# Altium schematic sheet mikrokontroller.SchDoc
size A
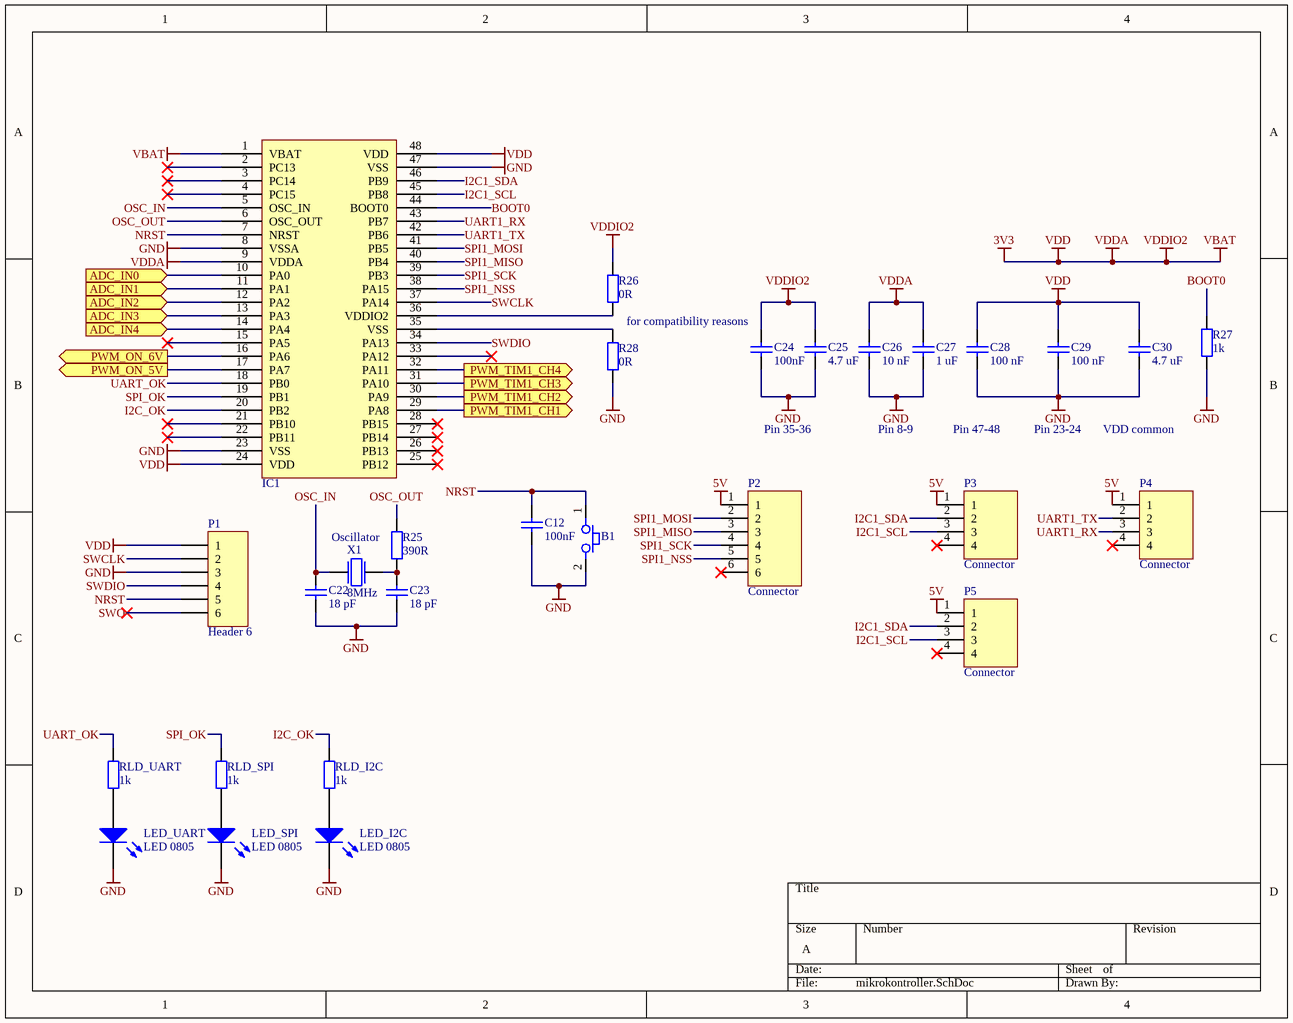
[diagram p0: mikrokontroller.SchDoc]

## Parts
B1  Button small  [FP_BTN_SMD_3x6]  (value not drawn)
C12  100nF  [0805_C]
C22  18 pF  [0805_C]
C23  18 pF  [0805_C]
C24  100nF  [0805_C]
C25  4.7 uF  [0805_C]
C26  10 nF  [0805_C]
C27  1 uF  [0805_C]
C28  100 nF  [0805_C]
C29  100 nF  [0805_C]
C30  4.7 uF  [0805_C]
IC1  STM32F091CBT6  [LQFP48]  (value not drawn)
LED_I2C  LED 0805  [0805_LED_G]
LED_SPI  LED 0805  [0805_LED_G]
LED_UART  LED 0805  [0805_LED_G]
P1  Header 6  [HDR1X6]
P2  Connector  [FP_CONN6_TAP_254MM]
P3  Connector  [FP_CONN4_TAP_254MM]
P4  Connector  [FP_CONN4_TAP_254MM]
P5  Connector  [FP_CONN4_TAP_254MM]
R25  390R  [0805_R]
R26  0R  [0805_R]
R27  1k  [0805_R]
R28  0R  [0805_R]
RLD_I2C  1k  [0805_R]
RLD_SPI  1k  [0805_R]
RLD_UART  1k  [0805_R]
X1  8MHz  [FP_CRYSTAL_HC49]

## Ports
ADC_IN0 (in), ADC_IN1 (in), ADC_IN2 (in), ADC_IN3 (in), ADC_IN4 (in), PWM_ON_5V (out), PWM_ON_6V (out), PWM_TIM1_CH1 (out), PWM_TIM1_CH2 (out), PWM_TIM1_CH3 (out), PWM_TIM1_CH4 (out)

## Nets
3V3: C24.1 C25.1 C26.1 C27.1 C28.1 C29.1 C30.1 IC1.1(VBAT) IC1.9(VDDA) IC1.24(VDD) IC1.48(VDD) P1.1 R26.2  [also labelled VBAT, VDD, VDDA, VDDIO2]
5V: P2.1 P3.1 P4.1 P5.1
GND: B1.2 C12.1 C22.2 C23.2 C24.2 C25.2 C26.2 C27.2 C28.2 C29.2 C30.2 IC1.8(VSSA) IC1.23(VSS) IC1.47(VSS) LED_I2C.2(K) LED_SPI.2(K) LED_UART.2(K) P1.3 R27.1 R28.1
ADC_IN0: IC1.10(PA0) ; port ADC_IN0
ADC_IN1: IC1.11(PA1) ; port ADC_IN1
ADC_IN2: IC1.12(PA2) ; port ADC_IN2
ADC_IN3: IC1.13(PA3) ; port ADC_IN3
ADC_IN4: IC1.14(PA4) ; port ADC_IN4
BOOT0: IC1.44(BOOT0) R27.2
I2C1_SCL: IC1.45(PB8) P3.3 P5.3
I2C1_SDA: IC1.46(PB9) P3.2 P5.2
I2C_OK: IC1.20(PB2) RLD_I2C.1
NRST: B1.1 C12.2 IC1.7(NRST) P1.5
OSC_IN: C22.1 IC1.5(OSC_IN) X1.1
OSC_OUT: IC1.6(OSC_OUT) R25.2
PWM_ON_5V: IC1.17(PA7) ; port PWM_ON_5V
PWM_ON_6V: IC1.16(PA6) ; port PWM_ON_6V
PWM_TIM1_CH1: IC1.29(PA8) ; port PWM_TIM1_CH1
PWM_TIM1_CH2: IC1.30(PA9) ; port PWM_TIM1_CH2
PWM_TIM1_CH3: IC1.31(PA10) ; port PWM_TIM1_CH3
PWM_TIM1_CH4: IC1.32(PA11) ; port PWM_TIM1_CH4
SPI1_MISO: IC1.40(PB4) P2.3
SPI1_MOSI: IC1.41(PB5) P2.2
SPI1_NSS: IC1.38(PA15) P2.5
SPI1_SCK: IC1.39(PB3) P2.4
SPI_OK: IC1.19(PB1) RLD_SPI.1
SWCLK: IC1.37(PA14) P1.2
SWDIO: IC1.34(PA13) P1.4
SWO: P1.6
UART1_RX: IC1.43(PB7) P4.3
UART1_TX: IC1.42(PB6) P4.2
UART_OK: IC1.18(PB0) RLD_UART.1
NetC23_1: C23.1 R25.1 X1.2
NetIC1_35: IC1.35(VSS) R28.2
NetIC1_36: IC1.36(VDDIO2) R26.1
NetLED_I2C_1: LED_I2C.1(A) RLD_I2C.2
NetLED_SPI_1: LED_SPI.1(A) RLD_SPI.2
NetLED_UART_1: LED_UART.1(A) RLD_UART.2

Not connected (* = marked no-connect by the designer): IC1 2(PC13)* 3(PC14)* 4(PC15)* 15(PA5)* 21(PB10)* 22(PB11)* 25(PB12)* 26(PB13)* 27(PB14)* 28(PB15)* 33(PA12)*; P2 6*; P3 4*; P4 4*; P5 4*

## Notes on the sheet
- for compatibility reasons
- Pin 35-36
- Pin 8-9
- Pin 47-48
- Pin 23-24
- VDD common
- (near R25) Oscillator

## Library data of the parts
B1 = Button small: Push button; Name: TACT 3x 6 2P SPST 1 TS-363 (FEM) SMD 3.5x6mm H=4.3mm; Reference: 45-08-58; Supplier: Lomex
C12 C22-C30 = CAP 0805
LED_I2C LED_SPI LED_UART = LED 0805: Aranyos világító ledecskék
P1 = Header 6: Header, 6-Pin; LatestRevisionDate: 17-Jul-2002; LatestRevisionNote: Re-released for DXP Platform.; Publisher: Altium Limited
P2 = Connector_6pin: 6pin connector
P3-P5 = Connector_4pin: 4pin Connector
R25-R28 RLD_I2C RLD_SPI RLD_UART = RES 0805
X1 = Crystal: Quarz Crystal; Name: 8.000000MHz QUARZ HC49/S (NSK) 30ppm 20pF LOW PROFILE; Value: 8MHz; Reference: 40-01-16; Supplier: Lomex